# EAGLE design ScreenCircuitV1 (EAGLE 8.4.1)
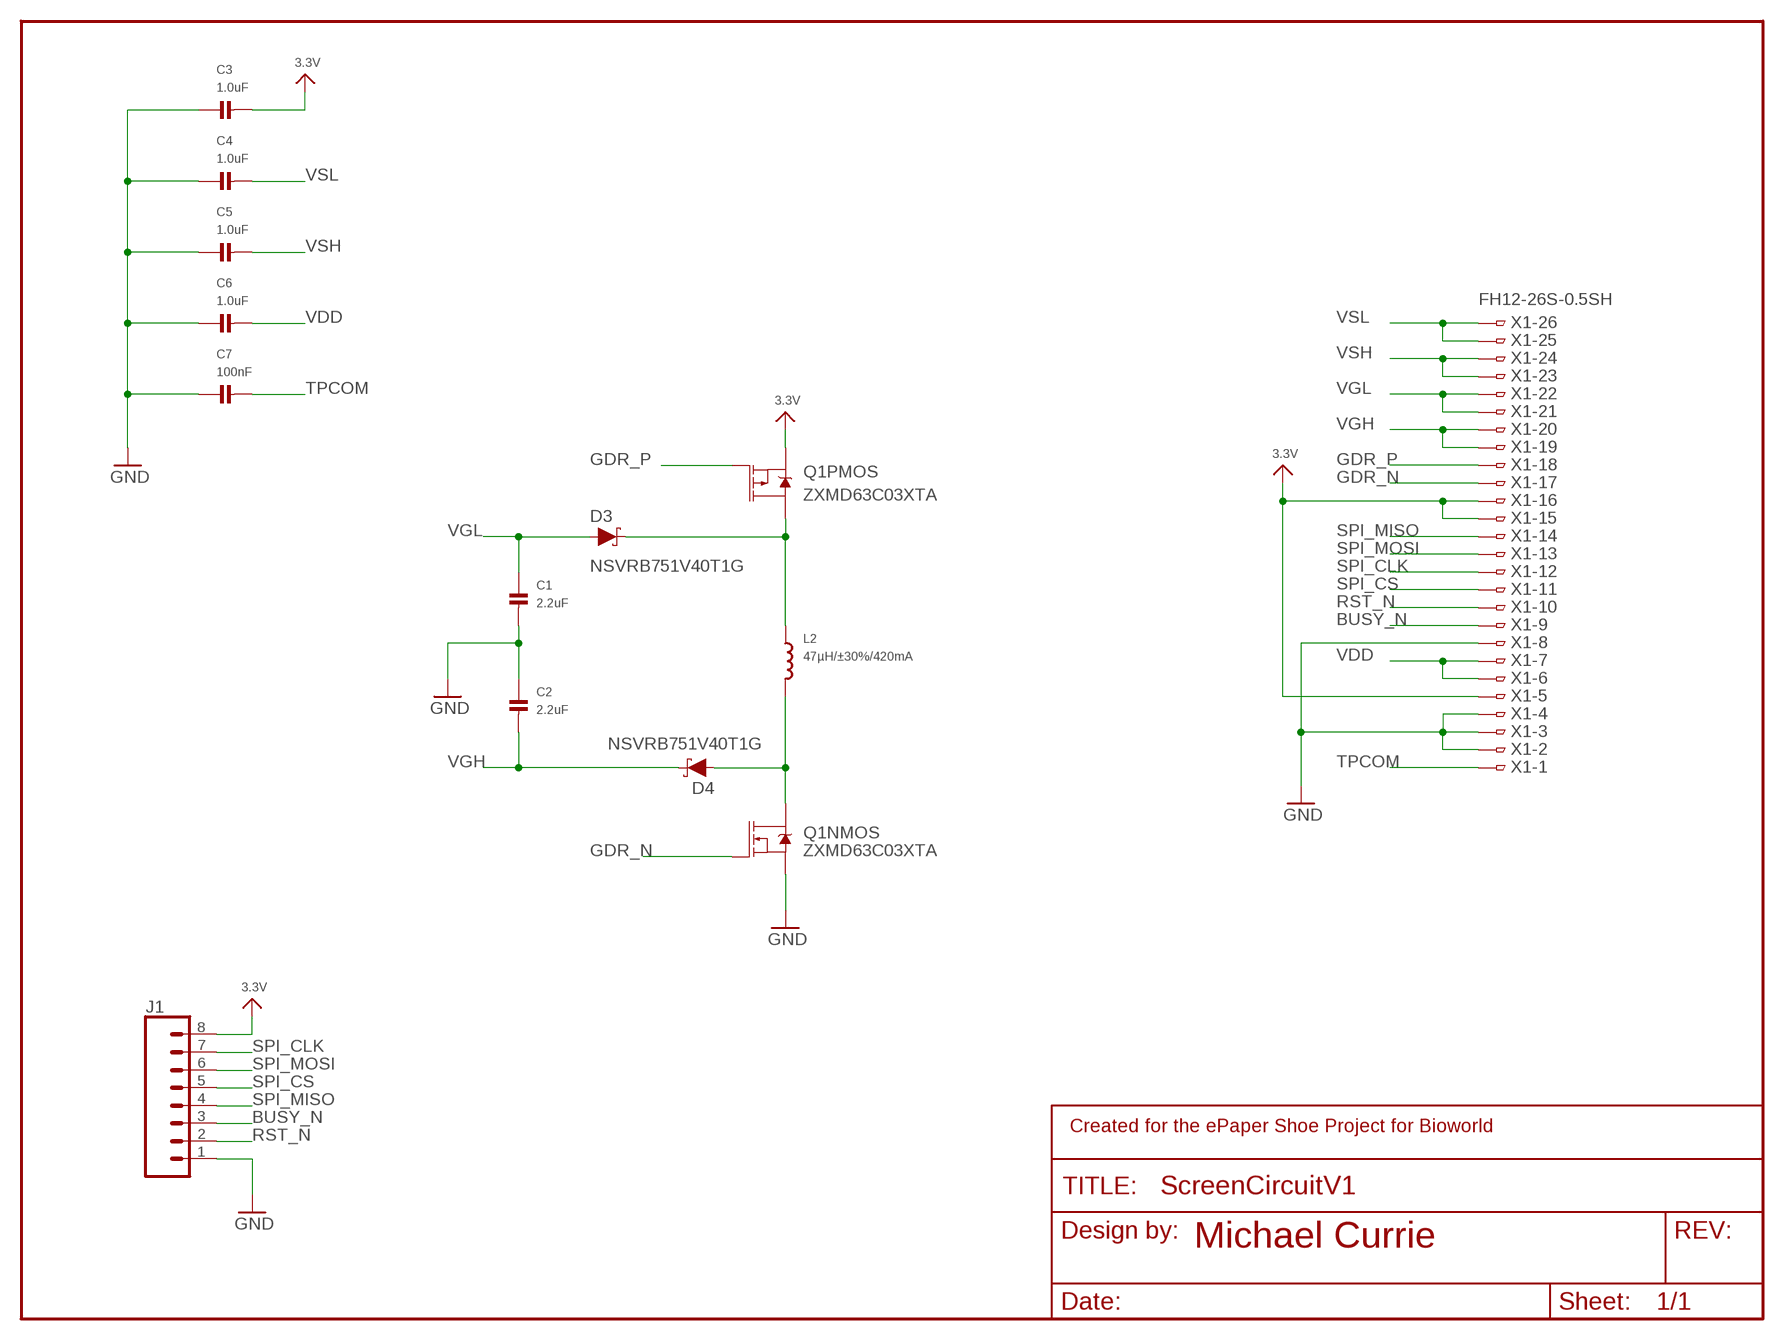
[diagram p0: schematic, sheet 1]

## Parts
C1  2.2uF  CAP_CERAMIC0805  [0805]
C2  2.2uF  CAP_CERAMIC0805  [0805]
C3  1.0uF  CAP_CERAMIC0805  [0805]
C4  1.0uF  CAP_CERAMIC0805  [0805]
C5  1.0uF  CAP_CERAMIC0805  [0805]
C6  1.0uF  CAP_CERAMIC0805  [0805]
C7  100nF  CAP_CERAMIC0805  [0805]
D3  0.5A/40V/420mV  DIODE-SCHOTTKY-PMEG4005EJ  [SOD-323]
D4  0.5A/40V/420mV  DIODE-SCHOTTKY-PMEG4005EJ  [SOD-323]
FRAME1  FRAME-LETTER-MICHAELNO_PACKAGE  [DUMMY]
J1  CONN_08"  [1X08]
L2  47µH/±30%/420mA  INDUCTORNR5040  [INDUCTOR_5X5MM_NR5040_NOTHERMALS]
Q1  IRF7509  [MSOP8]
X1  FH12-26S-0.5SH  [FH12-26S-0.5SH]

## Nets
3.3V: C3.2 J1.8 Q1.3(PMOS:S) X1.5 X1.15 X1.16
BUSY_N: J1.3 X1.9
GDR_N: Q1.2(NMOS:G) X1.17
GDR_P: Q1.4(PMOS:G) X1.18
GND: C1.2 C2.1 C3.1 C4.1 C5.1 C6.1 C7.1 J1.1 Q1.1(NMOS:S) X1.2 X1.3 X1.4 X1.8
N$3: D3.C L2.P$1 Q1.5(PMOS:D) Q1.6(PMOS:D)
N$5: D4.A L2.P$2 Q1.7(NMOS:D) Q1.8(NMOS:D)
RST_N: J1.2 X1.10
SPI_CLK: J1.7 X1.12
SPI_CS: J1.5 X1.11
SPI_MISO: J1.4 X1.14
SPI_MOSI: J1.6 X1.13
TPCOM: C7.2 X1.1
VDD: C6.2 X1.6 X1.7
VGH: C2.2 D4.C X1.19 X1.20
VGL: C1.1 D3.A X1.21 X1.22
VSH: C5.2 X1.23 X1.24
VSL: C4.2 X1.25 X1.26

## Notes on the sheet
- ZXMD63C03XTA
- NSVRB751V40T1G
- NSVRB751V40T1G
- ZXMD63C03XTA

## Library data of the parts
C1-C7 = microbuilder:CAP_CERAMIC: Ceramic Capacitors 0402 - 0402 Surface Mount Capacitors 16pF 50V 5% [Digikey: 445-4899-2-ND] 18pF 50V 5% [Digikey: 490-1281-2-ND] 22pF 50V 5% [Digikey: 490-1283-2-ND] 68pF 50V 5% [Digikey: 490-1289-2-ND] 0.1uF 10V 10% [Digikey: 490-1318-2-ND] 1.0uF 6.3V 10% [Digikey: 490-1320-2-ND] 0603 - 0603 Surface Mount Capacitors 16 pF 50V 5% [Digikey: 445-5051-2-ND] 22 pF 50V [Digikey: PCC220ACVTR-ND] 33 pF 50V 5% [Digikey: 490-1415-1-ND] 56pF 50V 5% [Digikey: 490-1421-1-ND] 220pF 50V 5% [Digikey: 445-1285-1-ND] 680 pF 50V 2200 pF 50V 5% C0G [Digikey: 445-1297-1-ND] 5600 pF 100V 5% X7R [Digikey: 478-3711-1-ND] 0.1 µF 25V 10% [Digikey: PCC2277TR-ND] 0.22 µF 16V 10% X7R [Digikey: 445-1318-1-ND] 1.0 µF 25V 10% [Digikey: 445-5146-2-ND] 0603 - RF Specific 3pF 250V +/-0.1pF RF [Digikey: 712-1347-1-ND] 18 pF 250V 5% [Digikey: 478-3505-1-ND or 712-1322-1-ND] 56 pF 250V 5% C0G RF [Digikey: 490-4867-1-ND] 68 pF 250V RF [Digikey: 490-4868-1-ND] 0805 - 0805 Surface Mount Capacitors 220 pF 250V 2% RF Ceramic Capacitor [Digikey: 712-1398-1-ND] 1000 pF 50V 2% NP0 Ceramic Capacitor [Digikey: 478-3760-1-ND] 0.1 µF 25V 10% Ceramic Capacitor [Digikey: PCC1828TR-ND] 1.0 µF 16V 10% Ceramic Capacitor[Digikey: 490-1691-2-ND] 10.0 µF 10V 10% Ceramic Capacitor[Digikey: 709-1228-1-ND] 10.0 uF 16V 10% Ceramic Capacitor [Digikey: 478-5165-2-ND] 47 uF 6.3V 20% Ceramic Capacitor [Digikey: 587-1779-1-ND or 399-5506-1-ND] 1206 - 1206 Surface Mount Capacitors 47uF 10V 20% Ceramic Capacitor [Digikey: 490-5528-1-ND or 399-5508-1-ND or 445-6010-1-ND] 100uF 6.3V -20%, +80% Y5V Ceramic Capacitor (Digikey: 490-4512-1-ND, Mouser: 81-GRM31CF50J107ZE1L)
D3 D4 = SparkFun-DiscreteSemi:DIODE-SCHOTTKY: Schottky diode A Schottky diode is a semiconductor diode which has a low forward voltage drop and a very fast switching action.; PROD_ID: DIO-10955
FRAME1 = SparkFun-Aesthetics:FRAME-LETTER-MICHAEL: Schematic Frame - Letter Standard 8.5x11 US Letter frame; DESIGNER: Nobody; VERSION: v01
J1 = SparkFun-Connectors:CONN_08: Multi connection point. Often used as Generic Header-pin footprint for 0.1 inch spaced/style header connections On any of the 0.1 inch spaced packages, you can populate with these: Break Away Headers - Straight <https://www.sparkfun.com/products/116> (PRT-00116) Break Away Male Headers - Right Angle <https://www.sparkfun.com/products/553> (PRT-00553) Female Headers <https://www.sparkfun.com/products/115> (PRT-00115) Break Away Headers - Machine Pin <https://www.sparkfun.com/products/117> (PRT-00117) Break Away Female Headers - Swiss Machine Pin <https://www.sparkfun.com/products/743> (PRT-00743) Arduino Stackable Header - 8 Pin <https://www.sparkfun.com/products/9279> (PRT-09279) For SCREWTERMINALS and SPRING TERMINALS visit here: Screw Terimnals on SparkFun.com <https://www.sparkfun.com/search/results?term=Screw+Terminals> (5mm/3.5mm/2.54mm spacing) This device is also useful as a general connection point to wire up your design to another part of your project. Our various solder wires solder well into these plated through hole pads. Hook-Up Wire - Assortment (Stranded, 22 AWG) <https://www.sparkfun.com/products/11375> (PRT-11375) Hook-Up Wire - Assortment (Solid Core, 22 AWG) <https://www.sparkfun.com/products/11367> (PRT-11367) View the entire wire category on our website here <https://www.sparkfun.com/categories/141> Special notes: Molex polarized connector foot print use with SKU : PRT-08231 with associated crimp pins and housings. 1MM SMD Version SKU: PRT-10208 NOTES ON THE VARIANTS LOCK and LOCK_LONGPADS... This footprint was designed to help hold the alignment of a through-hole component (i.e. 6-pin header) while soldering it into place. You may notice that each hole has been shifted either up or down by 0.005 of an inch from it's more standard position (which is a perfectly straight line). This slight alteration caused the pins (the squares in the middle) to touch the edges of the holes. Because they are alternating, it causes a "brace" to hold the component in place. 0.005 has proven to be the perfect amount of "off-center" position when using our standard breakaway headers. Although looks a little odd when you look at the bare footprint, once you have a header in there, the alteration is very hard to notice. Also,if you push a header all the way into place, it is covered up entirely on the bottom side.; PROD_ID: CONN-08438
L2 = microbuilder:INDUCTOR: Inductors 0603: 10nH Ceramic Inductor - microwire antenna/RF (Digikey: 712-1434-2-ND) 0805: 560nH Ceramic Inductor - RF (Digikey: 553-1047-1-ND) 270nH Ceramic Inductor - Q = 40@250MHz, +-5%, 1 Ohm DC Resistance (Digikey: 535-10506-2-ND) 1007 (2518 Metric) SMT: 10µH 10% 250mOhm 820mA 1007 Inductor (Digikey: 587-2189-1-ND) 22µH 10% 500mOhm 580mA 1007 Inductor (Digikey: 587-2190-1-ND) 47µH 10% 950mOhm 420mA 1007 Inductor (Digikey: 587-2191-1-ND) 47µH 5% 100mOhm 1A 1008 Inductor (Digikey: 732-1816-1-ND) 5.0x5.0mm (Taiyo Yuden NR5040 Series) 6.8µH 20% 2.3A 64mOhm Inductor (Digikey: 587-2374-2-ND) 5.0x5.0mm (TDK VLC5045 Series) 4.7µH 20% 3.3A 34mOhm Inductor (Digikey: 445-6526-1-ND) 6.8µH 20% 2.7A 46mOhm Inductor (Digikey: 445-6527-1-ND) 6.0x6.0mm (TDK VLC6045 Series) 4.7µH 20% 3.8A 27mOhm Inductor (Digikey: 445-6538-2-ND) 6.8µH 20% 3A 41mOhm Inductor (Digikey: 445-6540-1-ND) 6.2µH 30% 2.2A 45mOhm Inductor (Digikey: SRR5028-6R2YCT-ND) - Not TDK VLC6045 but footprint should match 6.0x6.0mm (TDK SLF6045 Series) 6.8uH 30% 2A 33mOhm Inductor (Digikey: 445-4572-1-ND, Mouser: 810-SLF645T6R8N2R0PF)
Q1 = SparkFun-DiscreteSemi:IRF7509: Dual N and P Channel MOSFET Dual N/P-Channel 30V 1.25 W 7.8/7.5 nC Hexfet Power Mosfet Surface Mount-MICRO-8. NMOS RDS(ON) 0.11Ω. PMOS RDS(ON) 0.20Ω. Link to datasheet <http://www.irf.com/product-info/datasheets/data/irf7509pbf.pdf> SparkFun Products: SparkFun RedBot Mainboard <https://www.sparkfun.com/products/12097> SparkFun Wake on Shake <https://www.sparkfun.com/products/11447>; PROD_ID: TRANS-07913
X1 = con-hirose:FH12-26S-0.5S: 0.5mm Pitch Connectors For FPC/FFC Source: Data sheet <http://www.hirose.co.jp/cataloge_hp/e58605370.pdf>; MPN: FH12-26S-0.5SH(55); OC_FARNELL: 1324553; OC_NEWARK: 34M6172

## Board
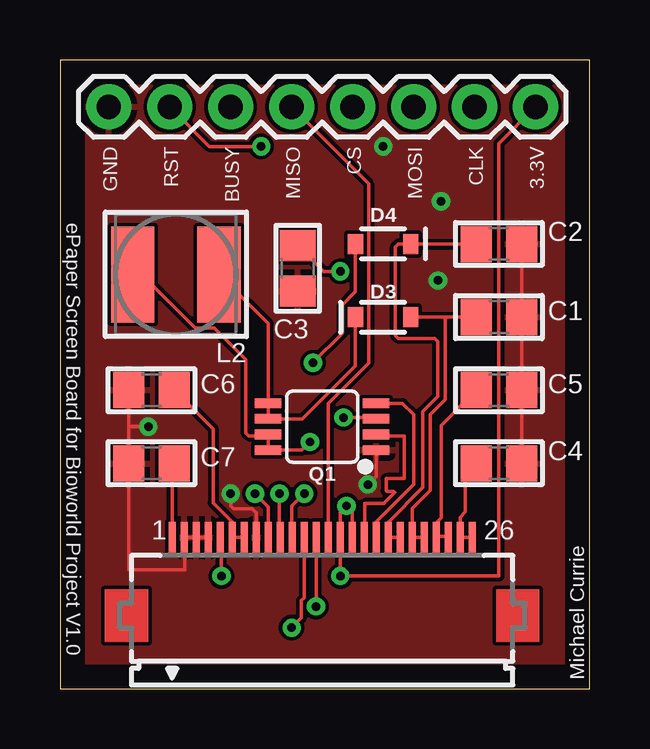
[diagram p1: board, top side]
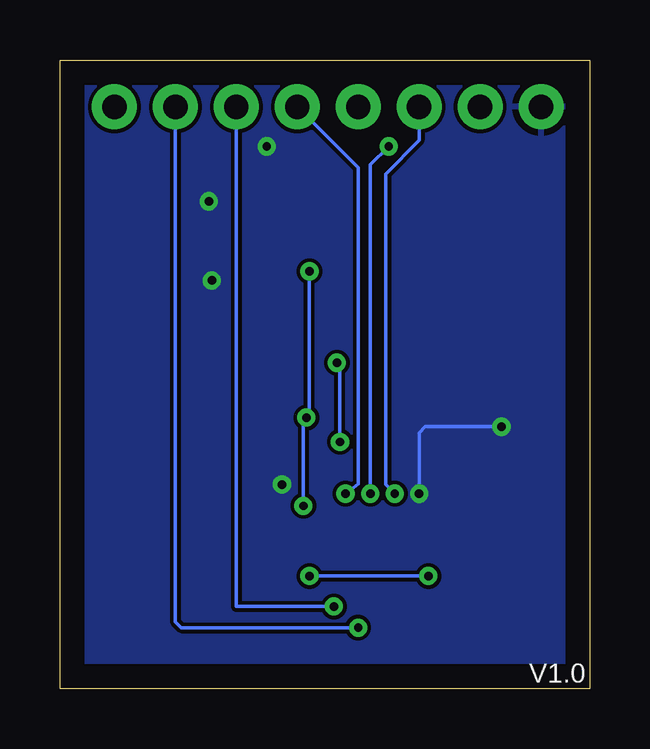
[diagram p2: board, bottom side, seen from below]

Size 22.08 x 26.21 mm. Coordinates in mm from the lower left corner, seen from the top.
Outline: 0,0 22.08,0 22.08,26.21 0,26.21 0,0
Copper layers (1*16): Top 0.035mm / dielectric 1.5mm / Bottom 0.035mm
Design rules "default": minimum track width 6mil, minimum drill 0.35mm, track to track 6mil, track to pad 6mil, pad to pad 6mil, via to via 6mil, smd to smd 6mil, copper to edge 40mil, drill to drill 6mil, minimum pad ring 10mil, minimum via ring 8mil, stop-mask expansion 4mil, vias tented up to drill 0mil, thermal gap 10mil

### Footprints (pad centres in the part's own frame; a part is rotated, then mirrored left to right if it is on the bottom)
0805 = smd 1.3 x 1.5: 1 -0.95,0; 2 0.95,0
SOD-323 = smd 0.63 x 0.83: A 1.15,0; C -1.15,0
1X08 = drill 1.016 pad 1.88: 1 0,0; 2 2.54,0; 3 5.08,0; 4 7.62,0; 5 10.16,0; 6 12.7,0; 7 15.24,0; 8 17.78,0
INDUCTOR_5X5MM_NR5040_NOTHERMALS = smd 1.8 x 4: P$1 -1.8,0; P$2 1.8,0
MSOP8 = smd 0.4 x 1.1: 1 -0.975,-2.25; 2 -0.325,-2.25; 3 0.325,-2.25; 4 0.975,-2.25; 5 0.975,2.25; 6 0.325,2.25; 7 -0.325,2.25; 8 -0.975,2.25
FH12-26S-0.5SH = smd 0.3 x 1.3: 1 -6.25,3.25; 2 -5.75,3.25; 3 -5.25,3.25; 4 -4.75,3.25; 5 -4.25,3.25; 6 -3.75,3.25; 7 -3.25,3.25; 8 -2.75,3.25; 9 -2.25,3.25; 10 -1.75,3.25; 11 -1.25,3.25; 12 -0.75,3.25; 13 -0.25,3.25; 14 0.25,3.25; 15 0.75,3.25; 16 1.25,3.25; 17 1.75,3.25; 18 2.25,3.25; 19 2.75,3.25; 20 3.25,3.25; 21 3.75,3.25; 22 4.25,3.25; 23 4.75,3.25; 24 5.25,3.25; 25 5.75,3.25; 26 6.25,3.25

### Placement (x,y rotation side)
C1  18.29,15.49 0 top
C2  18.29,18.54 180 top
C3  9.91,17.53 90 top
C4  18.29,9.4 180 top
C5  18.29,12.45 180 top
C6  3.81,12.45 0 top
C7  3.81,9.4 0 top
D3  13.46,15.49 0 top
D4  13.46,18.54 180 top
FRAME1  22.61,26.67 0 top
J1  2.03,24.26 0 top
L2  4.83,17.27 180 top
Q1  10.92,10.92 90 top
X1  10.92,3.05 0 top

### Tracks (layer width: path | path; a pad name or v marks a point on that pad's centre or on a via)
3.3V  (via drill 0.35)
  Top 0.152: Q1.3 13.12,11.3 v11.81,11.3 | X1.16 12.17,7.39 v11.94,7.62 11.67,7.35 X1.15 v11.68,4.7 18.29,4.7 18.29,22.73 J1.8 | v6.73,4.7 X1.5 | v11.68,17.4 10.98,17.4 C3.2
  Bottom 0.152: v11.94,7.62 11.94,11.18 v11.81,11.3 11.68,11.3 v11.68,17.4 | v11.68,4.7 v6.73,4.7
BUSY_N  (via drill 0.35)
  Top 0.152: X1.9 8.67,7.58 v8.13,8.13
  Bottom 0.152: J1.3 7.11,22.86 8.51,21.46 8.51,8.51 v8.13,8.13
GDR_N
  Top 0.152: X1.17 12.7,6.33 12.7,7.7 12.7,7.72 13.51,7.72 13.51,7.75 13.95,8.18 13.89,8.23 13.61,8.23 13.59,8.26 13.59,8.76 14.35,8.76 14.35,10.54 13.23,10.54 Q1.2
GDR_P
  Top 0.152: Q1.4 14.27,11.9 14.73,11.43 14.73,8.51 13.17,6.95 X1.18
GND  (via drill 0.35)
  Top 0.152: C2.1 C1.2 C5.1 C4.1 | C6.1 C7.1 2.86,4.95 5.21,4.95 5.21,6.3 X1.2 X1.3 X1.4 | 2.86,10.79 2.86,10.92 v3.68,10.92 | v12.83,8.51 13.17,8.85 Q1.1 | X1.8 8.17,7.32 8,7.49 7.24,7.49 7.11,7.62 v7.11,8.13
  Bottom 0.152: v3.68,10.92 6.86,10.92 7.11,10.67 v7.11,8.13
  other vias: 13.46,22.61 15.88,20.32 15.75,17.02
  pour Top: 0,26.16 21.97,26.16 21.97,0 0,0
  pour Bottom: 0.13,26.04 21.84,26.04 21.84,0.13 0.13,0.13
N$3
  Top 0.152: D3.C 12.31,13.46 10.1,11.25 Q1.6 Q1.5 8.67,15.23 L2.P$1
N$5  (via drill 0.35)
  Top 0.152: 8.67,10.41 Q1.7 | 8.67,10.41 Q1.8 10.07,9.95 v10.41,10.29 | v10.54,13.59 11.77,14.82 11.77,16 12.31,16.55 D4.A | L2.P$2 3.4,17.27 5.63,15.04 6.42,15.04 7.75,13.72 7.75,10.67 7.87,10.54 8.55,10.54 8.67,10.41
  Bottom 0.152: v10.41,10.29 10.41,13.46 v10.54,13.59
RST_N  (via drill 0.35)
  Top 0.152: J1.2 6.22,22.61 v8.38,22.61 | v9.14,8.13 9.14,6.33 X1.10
  Bottom 0.152: v8.38,22.61 9.14,21.84 v9.14,8.13
SPI_CLK  (via drill 0.35)
  Top 0.152: X1.12 10.17,3.79 10.06,3.68 10.06,2.95 v9.65,2.54
  Bottom 0.152: v9.65,2.54 17.02,2.54 17.27,2.79 J1.7
SPI_CS  (via drill 0.35)
  Top 0.152: v10.18,8.13 10.05,8.02 9.65,7.62 9.65,6.32 X1.11
  Bottom 0.152: J1.5 9.65,21.72 9.65,8.53 v10.18,8.13
SPI_MISO
  Top 0.152: X1.14 11.17,11.88 12.86,13.57 12.86,21.05 J1.4
SPI_MOSI  (via drill 0.35)
  Top 0.152: v10.67,3.43 X1.13
  Bottom 0.152: v10.67,3.43 14.73,3.43 J1.6
TPCOM
  Top 0.152: X1.1 4.67,9.31 C7.2
VDD
  Top 0.152: C6.2 6.38,10.83 6.38,7.75 7.17,6.96 X1.6 X1.7
VGH
  Top 0.152: X1.20 14.22,6.35 14.22,6.3 X1.19 13.67,6.94 15.11,8.38 15.11,11.56 15.75,12.19 15.75,14.48 15.62,14.61 14.1,14.61 13.97,14.73 13.97,18.41 14.1,18.54 D4.C C2.2
VGL
  Top 0.152: X1.22 X1.21 14.67,7.51 15.42,8.26 15.42,11.43 16.05,12.07 16.05,15.42 16.13,15.49 | 16.13,15.49 C1.1 | D3.A 16.13,15.49
VSH
  Top 0.152: X1.24 16.13,6.34 15.67,6.34 X1.23 15.67,6.91 15.88,7.11 15.88,10.98 C5.2
VSL
  Top 0.152: C4.2 16.89,8.95 16.89,7.37 16.67,7.15 X1.25 X1.26

### Text on the board
tPlace: GND | RST | BUSY | MISO | CS | MOSI | CLK | 3.3V | ePaper Screen Board for Bioworld Project V1.0 | 1 | 26 | Michael Currie
bPlace: V1.0